# EAGLE design SparkFun_RelayBoard-Large-v16 (EAGLE 5.06)
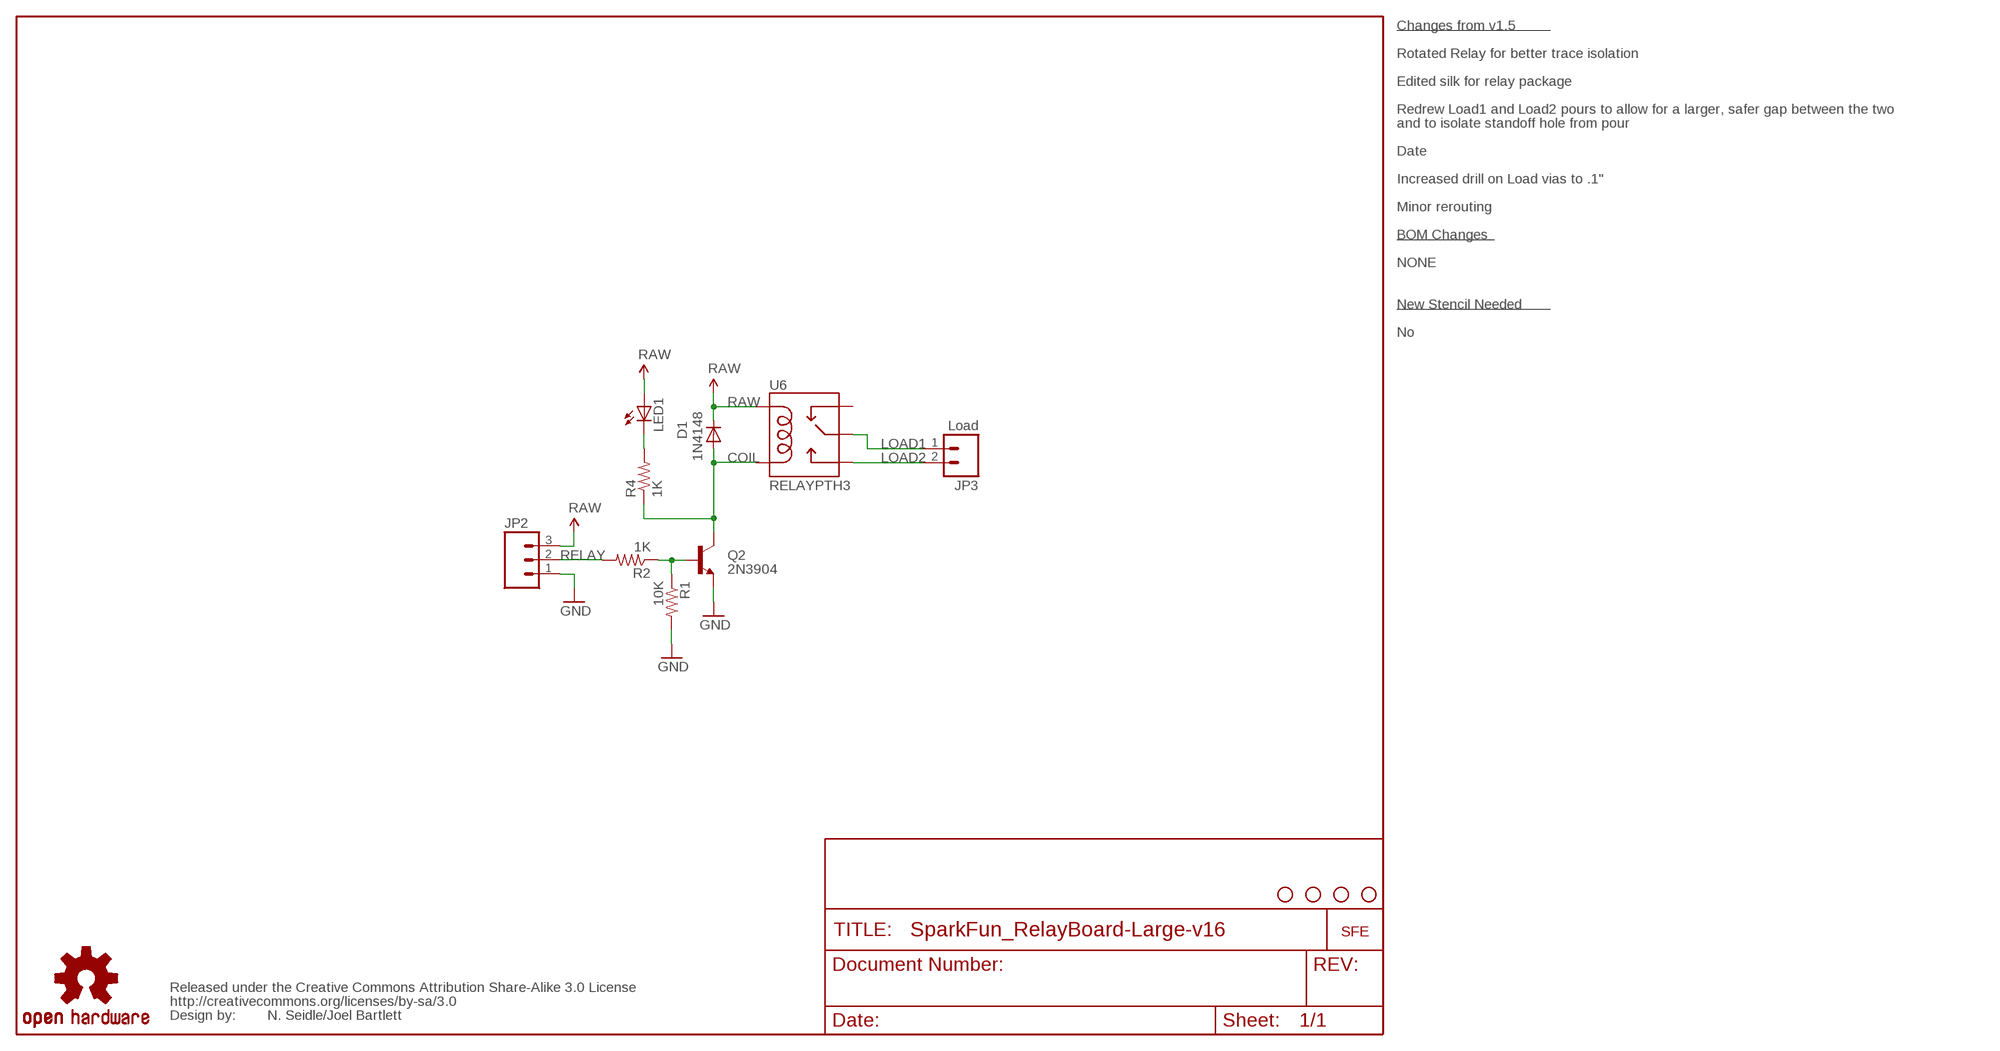
[diagram p0: schematic, sheet 1]

## Parts
D1  1N4148  DIODE1N4148  [DIODE-1N4148]
JP2  M03SCREW  [SCREWTERMINAL-3.5MM-3]
JP3  Load  M025MM  [SCREWTERMINAL-5MM-2]
LED1  LED5MM  [LED5MM]
Q2  2N3904  TRANSISTOR_NPNTO92  [TO-92]
R1  10K  RESISTORAXIAL-0.3  [AXIAL-0.3]
R2  1K  RESISTORAXIAL-0.3  [AXIAL-0.3]
R4  1K  RESISTORAXIAL-0.3  [AXIAL-0.3]
U6  RELAYPTH3  [RELAY-T9A-2]
U$1  LOGO-SFENEW  [SFE-NEW-WEBLOGO]
U$3  STAND-OFF  [STAND-OFF]
U$4  STAND-OFF  [STAND-OFF]
U$5  STAND-OFF  [STAND-OFF]
U$7  STAND-OFF  [STAND-OFF]
U$9  CREATIVE_COMMONS  [CREATIVE_COMMONS]
U$12  OSHW-LOGOS  [OSHW-LOGO-S]

## Nets
COIL: D1.A Q2.3(C) R4.P$1 U6.COIL2
GND: JP2.1 Q2.1(E) R1.P$2
LOAD1: JP3.1 U6.MAIN
LOAD2: JP3.2 U6.NO
N$6: Q2.2(B) R1.P$1 R2.P$1
N$9: LED1.K(C) R4.P$2
RAW: D1.C JP2.3 LED1.A U6.COIL1
RELAY: JP2.2 R2.P$2
Unconnected: U6.NC

## Notes on the sheet
- Changes from v1.5
- Rotated Relay for better trace isolation
- Edited silk for relay package
- Redrew Load1 and Load2 pours to allow for a larger, safer gap between the two
- and to isolate standoff hole from pour
- Date
- Increased drill on Load vias to .1"
- Minor rerouting
- BOM Changes
- NONE
- New Stencil Needed
- No
- N. Seidle/Joel Bartlett

## Library data of the parts
D1 = SparkFun:DIODE: Diode These are standard reverse protection diodes and small signal diodes. SMA package can handle up to about 1A. SOD-323 can handle about 200mA. What the SOD-323 package when ordering, there are some mfgs out there that are 5-pin packages.
JP2 = SparkFun:M03: Header 3 Standard 3-pin 0.1" header. Use with straight break away headers (SKU : PRT-00116), right angle break away headers (PRT-00553), swiss pins (PRT-00743), machine pins (PRT-00117), and female headers (PRT-00115). Molex polarized connector foot print use with SKU : PRT-08232 with associated crimp pins and housings.
JP3 = SparkFun:M02: Header 2 Standard 2-pin 0.1" header. Use with straight break away headers (SKU : PRT-00116), right angle break away headers (PRT-00553), swiss pins (PRT-00743), machine pins (PRT-00117), and female headers (PRT-00115). Molex polarized connector foot print use with SKU : PRT-08233 with associated crimp pins and housings.
LED1 = SparkFun:LED: LEDs Standard schematic elements and footprints for 5mm, 3mm, 1206, and 0603 sized LEDs. 5mm - Spark Fun Electronics SKU : COM-00529 (and others)
Q2 = SparkFun:TRANSISTOR_NPN: Transistor NPN BJT configuration in SOT23 package. MMBT2222 is the common NPN we use. Double check BCE configuration again layout.
R1 R2 R4 = SparkFun:RESISTOR: Resistor Basic schematic elements and footprints for 0603, 1206, and PTH resistors.
U6 = SparkFun:RELAY
U$1 = SparkFun:LOGO-SFE: Spark Fun Electronics PCB Logo This is the standard Spark Fun Electronics PCB logo.
U$3-U$5 U$7 = SparkFun:STAND-OFF: Stand Off This is the mechanical footprint for a #4 phillips button head screw. Use the keepout ring to avoid running the screw head into surrounding components. SKU : PRT-00447
U$9 = SparkFun:CREATIVE_COMMONS
U$12 = SparkFun:OSHW-LOGO: Open Source Hardware Logo This logo indicates the piece of hardware it is found on incorporates a OSHW license and/or adheres to the definition of open source hardware found here: http://freedomdefined.org/OSHW

## Board
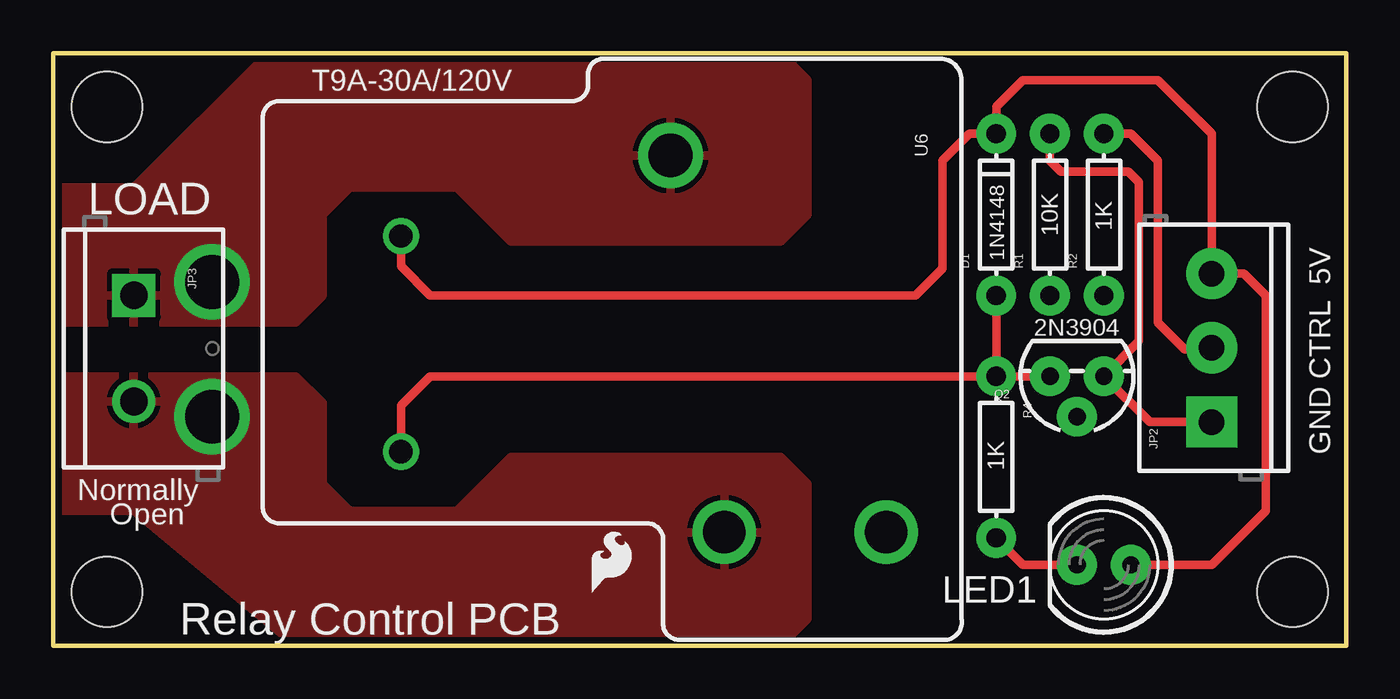
[diagram p1: board, top side]
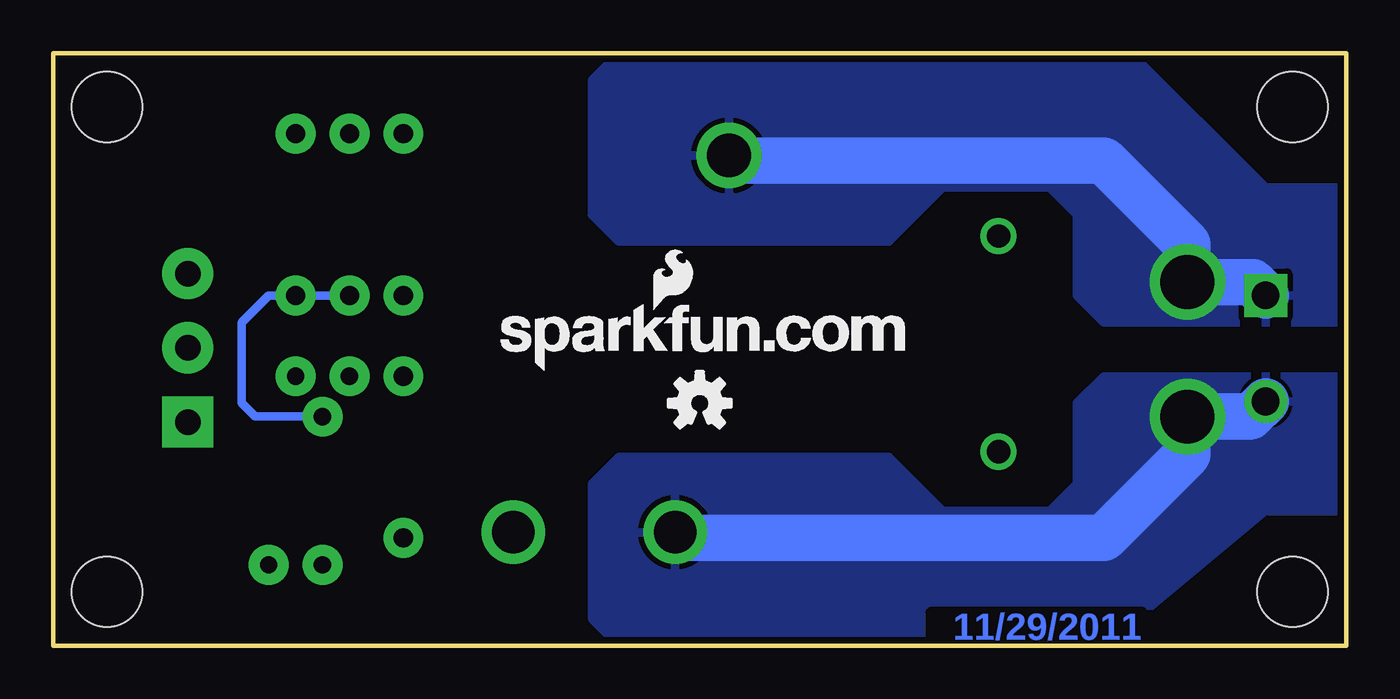
[diagram p2: board, bottom side, seen from below]

Size 60.96 x 27.94 mm. Coordinates in mm from the lower left corner, seen from the top.
Outline: 0,0 60.96,0 60.96,27.94 0,27.94 0,0
Copper layers (1*16): Top 0.035mm / dielectric 1.5mm / Bottom 0.035mm
Design rules "SparkFun": minimum track width 8mil, minimum drill 20mil, track to track 8mil, track to pad 8mil, pad to pad 8mil, via to via 8mil, smd to smd 8mil, copper to edge 8mil, drill to drill 8mil, minimum pad ring 12mil, minimum via ring 10mil, stop-mask expansion 4mil, vias tented up to drill 20mil, thermal gap 10mil

### Footprints (pad centres in the part's own frame; a part is rotated, then mirrored left to right if it is on the bottom)
DIODE-1N4148 = drill 0.9 pad 1.88 round: A -3.81,0; C 3.81,0
SCREWTERMINAL-3.5MM-3 = drill 1.2 pad 2.413 square: 1 0,0 | drill 1.2 pad 2.413 round: 2 3.5,0; 3 7,0
SCREWTERMINAL-5MM-2 = drill 1.3 pad 2.032 square: 1 0,0 | drill 1.3 pad 2.032 round: 2 5,0
LED5MM = drill 0.813 pad 1.88 round: A -1.27,0; K 1.27,0
TO-92 = drill 0.813 pad 1.88 round: 1 -1.27,0; 2 0,1.905; 3 1.27,0
AXIAL-0.3 = drill 0.9 pad 1.88 round: P$1 -3.81,0; P$2 3.81,0
RELAY-T9A-2 = drill 1.1 round: COIL1 -6.61,-10.27; COIL2 3.55,-10.27 | drill 2.057 round: MAIN -10.41,2.43 | drill 2 round: NC 7.35,12.6; NO 7.35,4.97
STAND-OFF = hole 3.302: 0,0

### Placement (x,y rotation side)
D1  44.45,20.32 90 top
JP2  54.61,10.54 90 top
JP3  3.81,16.51 270 top
LED1  49.53,3.81 180 top
Q2  48.26,12.7 180 top
R1  46.99,20.32 90 top
R2  49.53,20.32 90 top
R4  44.45,8.89 270 top
U6  26.67,12.7 270 top
U$1  39.88,12.95 0 bottom
U$3  2.54,2.54 0 top
U$4  58.42,2.54 0 top
U$5  58.42,25.4 0 top
U$7  2.54,25.4 0 top
U$9  20.32,-8.89 0 top  (outside the outline)
U$11  [SFE-LOGO-FLAME]  25.4,2.54 0 top
U$12  30.48,11.43 0 bottom

### Tracks (layer width: path | path; a pad name or v marks a point on that pad's centre or on a via)
COIL
  Top 0.406: R4.P$1 D1.A | U6.COIL2 16.4,11.32 17.78,12.7 R4.P$1 | R4.P$1 Q2.3
GND
  Top 0.406: JP2.1 51.69,10.54 Q2.1 51.18,14.35 51.18,21.84 50.67,22.35 47.5,22.35 46.99,22.86 R1.P$2
LOAD1  (via drill 2.54)
  Bottom 2.184: U6.MAIN 28.85,22.86 11.43,22.86 7.49,18.92 v7.49,17.14 4.45,17.14 JP3.1
  pour Top (isolate 0.305): 0,15.24 11.43,15.24 12.7,16.51 12.7,20.32 13.97,21.59 19.05,21.59 21.59,19.05 34.29,19.05 35.56,20.32 35.56,26.67 34.29,27.94 10.16,27.94 3.81,21.59 0,21.59
  pour Bottom (isolate 0.305): 0,15.24 11.43,15.24 12.7,16.51 12.7,20.32 13.97,21.59 19.05,21.59 21.59,19.05 34.29,19.05 35.56,20.32 35.56,26.67 34.29,27.94 10.16,27.94 3.81,21.59 0,21.59
LOAD2  (via drill 2.54)
  Bottom 2.184: U6.NO 31.37,5.08 11.43,5.08 7.49,9.02 v7.49,10.79 4.53,10.79 JP3.2
  pour Top (isolate 0.305): 0,12.7 11.43,12.7 12.7,11.43 12.7,7.62 13.97,6.35 19.05,6.35 21.59,8.89 34.29,8.89 35.56,7.62 35.56,1.27 34.29,0 11.43,0 3.81,6.35 0,6.35
  pour Bottom (isolate 0.305): 0,12.7 11.43,12.7 12.7,11.43 12.7,7.62 13.97,6.35 19.05,6.35 21.59,8.89 34.29,8.89 35.56,7.62 35.56,1.27 34.29,0 11.43,0 3.81,6.35 0,6.35
N$6
  Bottom 0.406: Q2.2 51.44,10.79 52.07,11.43 52.07,15.24 50.8,16.51 R2.P$1 R1.P$1
N$9
  Top 0.406: LED1.K 45.72,3.81 R4.P$2
RAW
  Top 0.406: LED1.A 54.61,3.81 57.15,6.35 57.15,16.51 56.12,17.54 JP2.3 54.61,24.13 52.07,26.67 45.72,26.67 44.45,25.4 D1.C 43.18,24.13 41.91,22.86 41.91,17.78 40.64,16.51 17.78,16.51 16.4,17.89 U6.COIL1
RELAY
  Top 0.406: R2.P$2 50.8,24.13 52.07,22.86 52.07,15.24 53.34,13.97 54.54,13.97 JP2.2

### Text on the board
Bottom: 11/29/2011
tPlace: T9A-30A/120V | LOAD | 5V | CTRL | GND | Normally | Open | Relay Control PCB | N. Seidle/Joel Bartlett